# Altium schematic sheet OurEDA-P1K_zynq.SchDoc
size A4; SheetNumber: 3; SheetTotal: 7
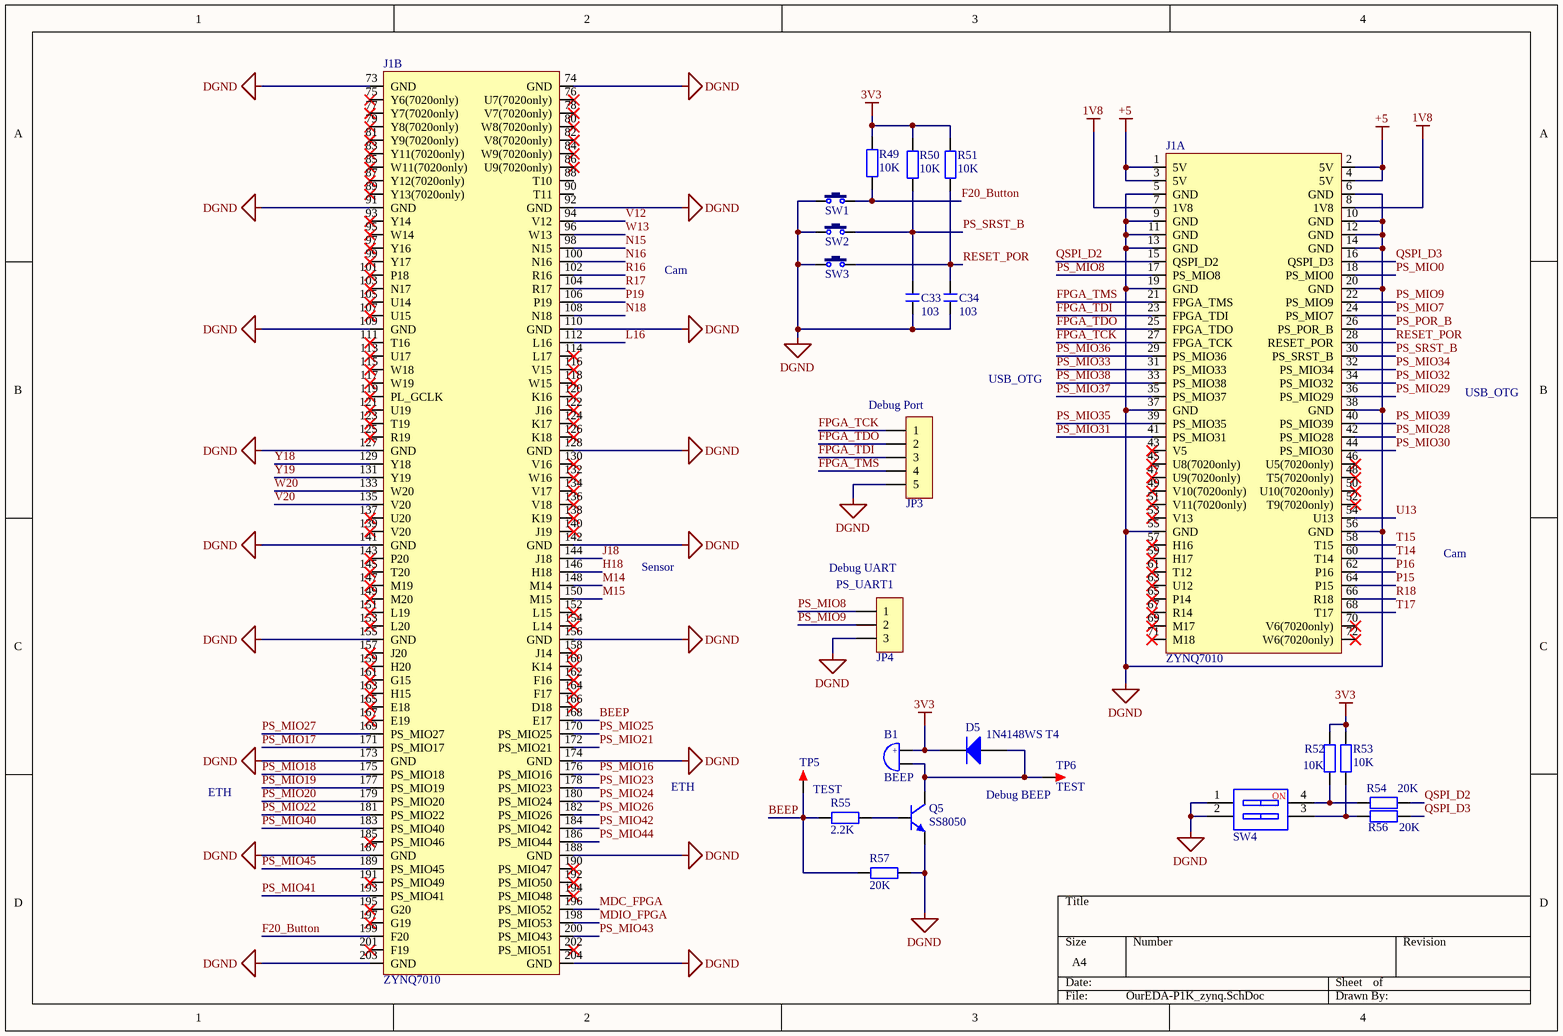
[diagram p0: OurEDA-P1K_zynq.SchDoc]

## Parts
B1  BEEP  [BEEP 5x9x5.5]
C33  103  [C 0603_L]
C34  103  [C 0603_L]
D5  1N4148WS T4  [SOD-323]
J1  ZYNQ7010  [DDR3_sodimm_Pin204]  (parts A,B of 2)
JP3  HDR-1X5  [MX 1.25-LS-5P]  (value not drawn)
JP4  HDR-1X3  [MX 1.25-LS-3P]  (value not drawn)
Q5  SS8050  [SOT23-3N]
R49  10K  [R 0603_L]
R50  10K  [R 0603_L]
R51  10K  [R 0603_L]
R52  10K  [R 0603_L]
R53  10K  [R 0603_L]
R54  20K  [R 0603_L]
R55  2.2K  [R 0603_L]
R56  20K  [R 0603_L]
R57  20K  [R 0603_L]
SW1  3x6x5  [TSW SMD-3*6*2.5]  (value not drawn)
SW2  3x6x5  [TSW SMD-3*6*2.5]  (value not drawn)
SW3  3x6x5  [TSW SMD-3*6*2.5]  (value not drawn)
SW4  CSW-2P  [CSW1.27 SMD-2P]  (value not drawn)
TP5  TEST  [TEST 1]
TP6  TEST  [TEST 1]

## Nets
1V8: J1.7(1V8) J1.8(1V8)
3V3: B1.1 D5.2(K) R49.2 R50.2 R51.2 R52.2 R53.2
+5: J1.1(5V) J1.2(5V) J1.3(5V) J1.4(5V)
DGND: C33.1 C34.1 J1.5(GND) J1.6(GND) J1.9(GND) J1.10(GND) J1.11(GND) J1.12(GND) J1.13(GND) J1.14(GND) J1.19(GND) J1.20(GND) J1.37(GND) J1.38(GND) J1.55(GND) J1.56(GND) J1.73(GND) J1.74(GND) J1.91(GND) J1.92(GND) J1.109(GND) J1.110(GND) J1.127(GND) J1.128(GND) J1.141(GND) J1.142(GND) J1.155(GND) J1.156(GND) J1.173(GND) J1.174(GND) J1.187(GND) J1.188(GND) J1.203(GND) J1.204(GND) JP3.5 JP4.3 Q5.2(E) R57.2 SW1.1 SW2.1 SW3.1 SW4.1 SW4.2
BEEP: J1.168(E17) R55.2 R57.1 TP5.1
F20_Button: J1.199(F20) R49.1 SW1.2
FPGA_TCK: J1.27(FPGA_TCK) JP3.1
FPGA_TDI: J1.23(FPGA_TDI) JP3.3
FPGA_TDO: J1.25(FPGA_TDO) JP3.2
FPGA_TMS: J1.21(FPGA_TMS) JP3.4
H18: J1.146(H18)
J18: J1.144(J18)
L16: J1.112(L16)
M14: J1.148(M14)
M15: J1.150(M15)
MDC_FPGA: J1.196(PS_MIO52)
MDIO_FPGA: J1.198(PS_MIO53)
N15: J1.98(N15)
N16: J1.100(N16)
N18: J1.108(N18)
P15: J1.64(P15)
P16: J1.62(P16)
P19: J1.106(P19)
PS_MIO0: J1.18(PS_MIO0)
PS_MIO7: J1.24(PS_MIO7)
PS_MIO8: J1.17(PS_MIO8) JP4.1
PS_MIO9: J1.22(PS_MIO9) JP4.2
PS_MIO16: J1.176(PS_MIO16)
PS_MIO17: J1.171(PS_MIO17)
PS_MIO18: J1.175(PS_MIO18)
PS_MIO19: J1.177(PS_MIO19)
PS_MIO20: J1.179(PS_MIO20)
PS_MIO21: J1.172(PS_MIO21)
PS_MIO22: J1.181(PS_MIO22)
PS_MIO23: J1.178(PS_MIO23)
PS_MIO24: J1.180(PS_MIO24)
PS_MIO25: J1.170(PS_MIO25)
PS_MIO26: J1.182(PS_MIO26)
PS_MIO27: J1.169(PS_MIO27)
PS_MIO28: J1.42(PS_MIO28)
PS_MIO29: J1.36(PS_MIO29)
PS_MIO30: J1.44(PS_MIO30)
PS_MIO31: J1.41(PS_MIO31)
PS_MIO32: J1.34(PS_MIO32)
PS_MIO33: J1.31(PS_MIO33)
PS_MIO34: J1.32(PS_MIO34)
PS_MIO35: J1.39(PS_MIO35)
PS_MIO36: J1.29(PS_MIO36)
PS_MIO37: J1.35(PS_MIO37)
PS_MIO38: J1.33(PS_MIO38)
PS_MIO39: J1.40(PS_MIO39)
PS_MIO40: J1.183(PS_MIO40)
PS_MIO41: J1.193(PS_MIO41)
PS_MIO42: J1.184(PS_MIO42)
PS_MIO43: J1.200(PS_MIO43)
PS_MIO44: J1.186(PS_MIO44)
PS_MIO45: J1.189(PS_MIO45)
PS_POR_B: J1.26(PS_POR_B)
PS_SRST_B: C33.2 J1.30(PS_SRST_B) R50.1 SW2.2
QSPI_D2: J1.15(QSPI_D2) R54.2
QSPI_D3: J1.16(QSPI_D3) R56.2
R16: J1.102(R16)
R17: J1.104(R17)
R18: J1.66(R18)
RESET_POR: C34.2 J1.28(RESET_POR) R51.1 SW3.2
T14: J1.60(T14)
T15: J1.58(T15)
T17: J1.68(T17)
U13: J1.54(U13)
V12: J1.94(V12)
V20: J1.135(V20)
W13: J1.96(W13)
W20: J1.133(W20)
Y18: J1.129(Y18)
Y19: J1.131(Y19)
NetB1_2: B1.2 D5.1(A) Q5.3(C) TP6.1
NetQ5_1: Q5.1(B) R55.1
NetR52_1: R52.1 R54.1 SW4.4
NetR53_1: R53.1 R56.1 SW4.3

Not connected (* = marked no-connect by the designer): J1 43(V5)* 45(U8(7020only))* 46(U5(7020only))* 47(U9(7020only))* 48(T5(7020only))* 49(V10(7020only))* 50(U10(7020only))* 51(V11(7020only))* 52(T9(7020only))* 53(V13)* 57(H16)* 59(H17)* 61(T12)* 63(U12)* 65(P14)* 67(R14)* 69(M17)* 70(V6(7020only))* 71(M18)* 72(W6(7020only))* 75(Y6(7020only))* 76(U7(7020only))* 77(Y7(7020only))* 78(V7(7020only))* 79(Y8(7020only))* 80(W8(7020only))* 81(Y9(7020only))* 82(V8(7020only))* 83(Y11(7020only))* 84(W9(7020only))* 85(W11(7020only))* 86(U9(7020only))* 87(Y12(7020only))* 88(T10) 89(Y13(7020only))* 90(T11) 93(Y14)* 95(W14)* 97(Y16)* 99(Y17)* 101(P18)* 103(N17)* 105(U14)* 107(U15)* 111(T16)* 113(U17)* 114(L17)* 115(W18)* 116(V15)* 117(W19)* 118(W15)* 119(PL_GCLK)* 120(K16)* 121(U19)* 122(J16)* 123(T19)* 124(K17)* 125(R19)* 126(K18)* 130(V16)* 132(W16)* 134(V17)* 136(V18)* 137(U20)* 138(K19)* 139(V20)* 140(J19)* 143(P20)* 145(T20)* 147(M19)* 149(M20)* 151(L19)* 152(L15)* 153(L20)* 154(L14)* 157(J20)* 158(J14)* 159(H20)* 160(K14)* 161(G15)* 162(F16)* 163(H15)* 164(F17)* 165(E18)* 166(D18)* 167(E19)* 185(PS_MIO46)* 190(PS_MIO47)* 191(PS_MIO49)* 192(PS_MIO50)* 194(PS_MIO48)* 195(G20)* 197(G19)* 201(F19)* 202(PS_MIO51)*

## Notes on the sheet
- Cam
- USB_OTG
- (near JP3) Debug Port
- Sensor
- (near JP4) Debug UART
- (near JP4) PS_UART1
- ETH
- (near TP6) Debug BEEP
- (in symbol BEEP) +
- (in symbol CSW-2P) NO

## Library data of the parts
B1 = BEEP: 蜂鸣器
C33 C34 = C: 无极性贴片电容; 版权归属: 源创客; BOM名称: 无极性贴片电容; 学习资源: www.ooocke.com
D5 = SOD-323 1N4148WS T4: 二极管; ComponentLink1Description: 供应商链接; ComponentLink1URL: http://www.szlcsc.com/product/details_2485.html; Package: SOD-323; Supplier: LC; SuppliersPartNumber: C2128
J1 = DDR3_sodimm_Pin204
JP3 = Header 5: 5P接插件; 版权归属: 源创客; BOM名称: 5P接插件; 学习资源: www.ooocke.com
JP4 = Header 3: 3P接插件; 版权归属: 源创客; BOM名称: 3P接插件; 学习资源: www.ooocke.com
Q5 = 8050-SMD: 高频放大-NPN型; 版权归属: 源创客; 属性: 40V 1.5A 1W 100MHZ; BOM名称: 高频放大-NPN型; 学习资源: www.ooocke.com
R49-R57 = R: 贴片电阻; 版权归属: 源创客; BOM名称: 贴片电阻; 学习资源: www.ooocke.com
SW1-SW3 = TSW 3x6: 3x6轻触开关; 版权归属: 源创客; BOM名称: 3x6轻触开关; 学习资源: www.ooocke.com
SW4 = CSW-2P: 2路编码开关; 版权归属: 源创客; BOM名称: 2路编码开关; 学习资源: www.ooocke.com
TP5 TP6 = TEST: 测试点; 版权归属: 源创客; BOM名称: 测试点; 学习资源: www.ooocke.com